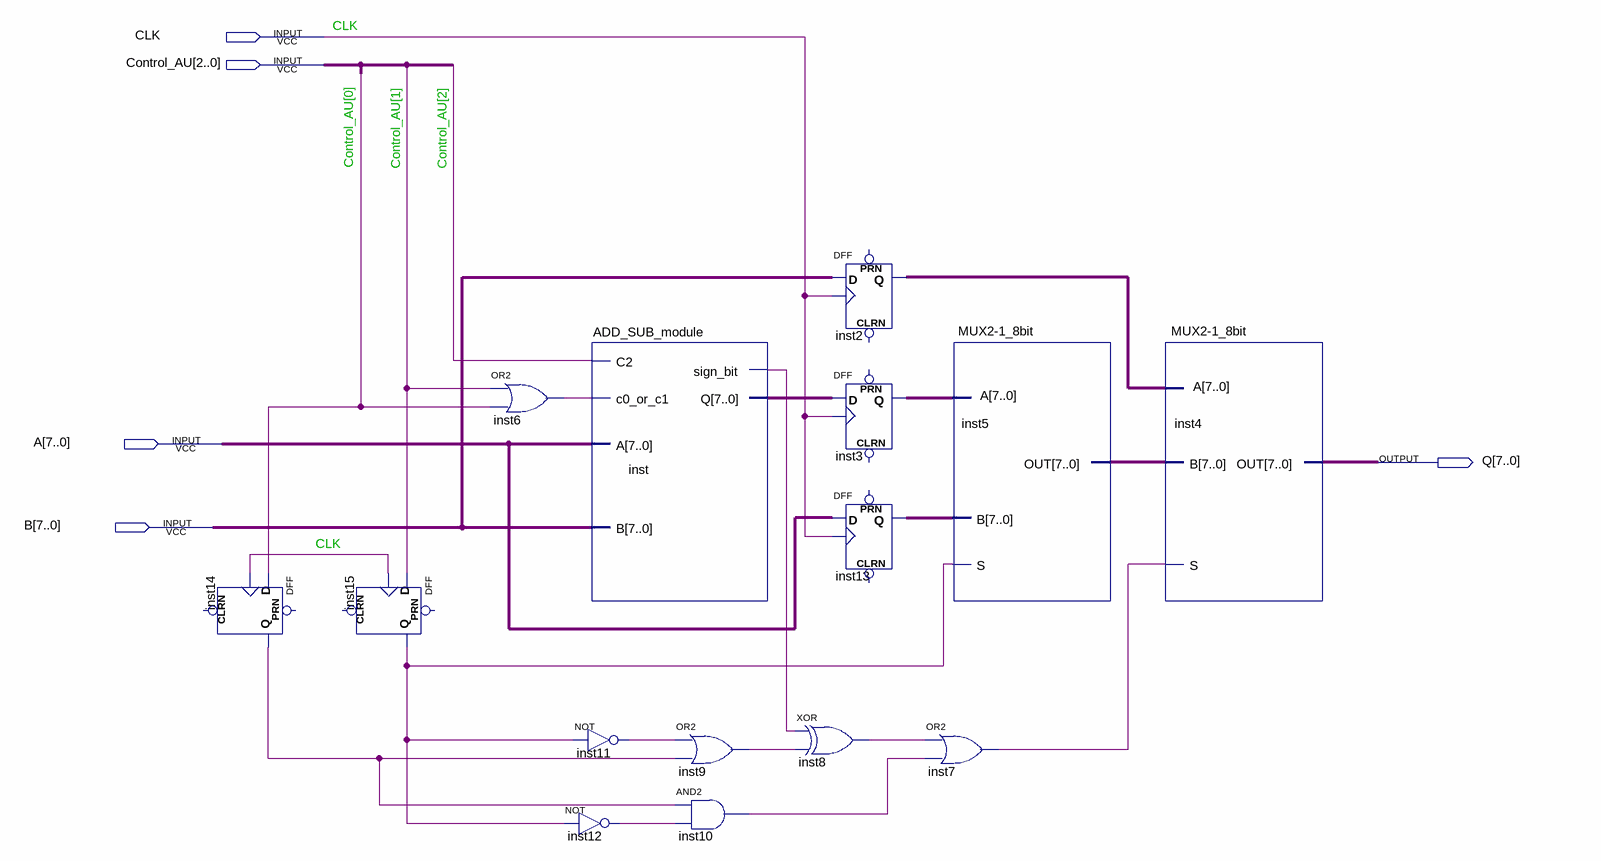
[diagram p0: schematic sheet]
// Quartus schematic AU.bdf as structural Verilog: 15 symbols, 5 pins
module AU (
  input  CLK,
  input  [2:0] Control_AU,
  input  [7:0] A,
  input  [7:0] B,
  output [7:0] Q
);

  wire inst6_out, inst7_out, inst8_out, inst9_out, inst10_out, inst11_out, inst12_out, inst14_q, inst15_q,
       inst_sign_bit;
  wire [7:0] inst2_q, inst3_q, inst5_out, inst13_q, inst_q;

  DFF inst14 (.CLK(CLK), .D(Control_AU[0]), .Q(inst14_q));  // open: CLRN, PRN
  DFF inst15 (.CLK(CLK), .D(Control_AU[1]), .Q(inst15_q));  // open: CLRN, PRN
  or inst6 (inst6_out, Control_AU[1], Control_AU[0]);
  not inst11 (inst11_out, inst15_q);
  not inst12 (inst12_out, inst15_q);
  ADD_SUB_module inst (.C2(Control_AU[2]), .B(B), .A(A), .c0_or_c1(inst6_out), .sign_bit(inst_sign_bit), .Q(inst_q));
  or inst9 (inst9_out, inst11_out, inst14_q);
  and inst10 (inst10_out, inst14_q, inst12_out);
  xor inst8 (inst8_out, inst_sign_bit, inst9_out);
  DFF inst2[7:0] (.CLK(CLK), .D(B), .Q(inst2_q));  // open: CLRN, PRN
  DFF inst3[7:0] (.CLK(CLK), .D(inst_q), .Q(inst3_q));  // open: CLRN, PRN
  DFF inst13[7:0] (.CLK(CLK), .D(A), .Q(inst13_q));  // open: CLRN, PRN
  or inst7 (inst7_out, inst8_out, inst10_out);
  \MUX2-1_8bit  inst5 (.S(inst15_q), .A(inst3_q), .B(inst13_q), .OUT(inst5_out));
  \MUX2-1_8bit  inst4 (.S(inst7_out), .A(inst2_q), .B(inst5_out), .OUT(Q));
endmodule
